# EAGLE design receiver (EAGLE 7.3.0)
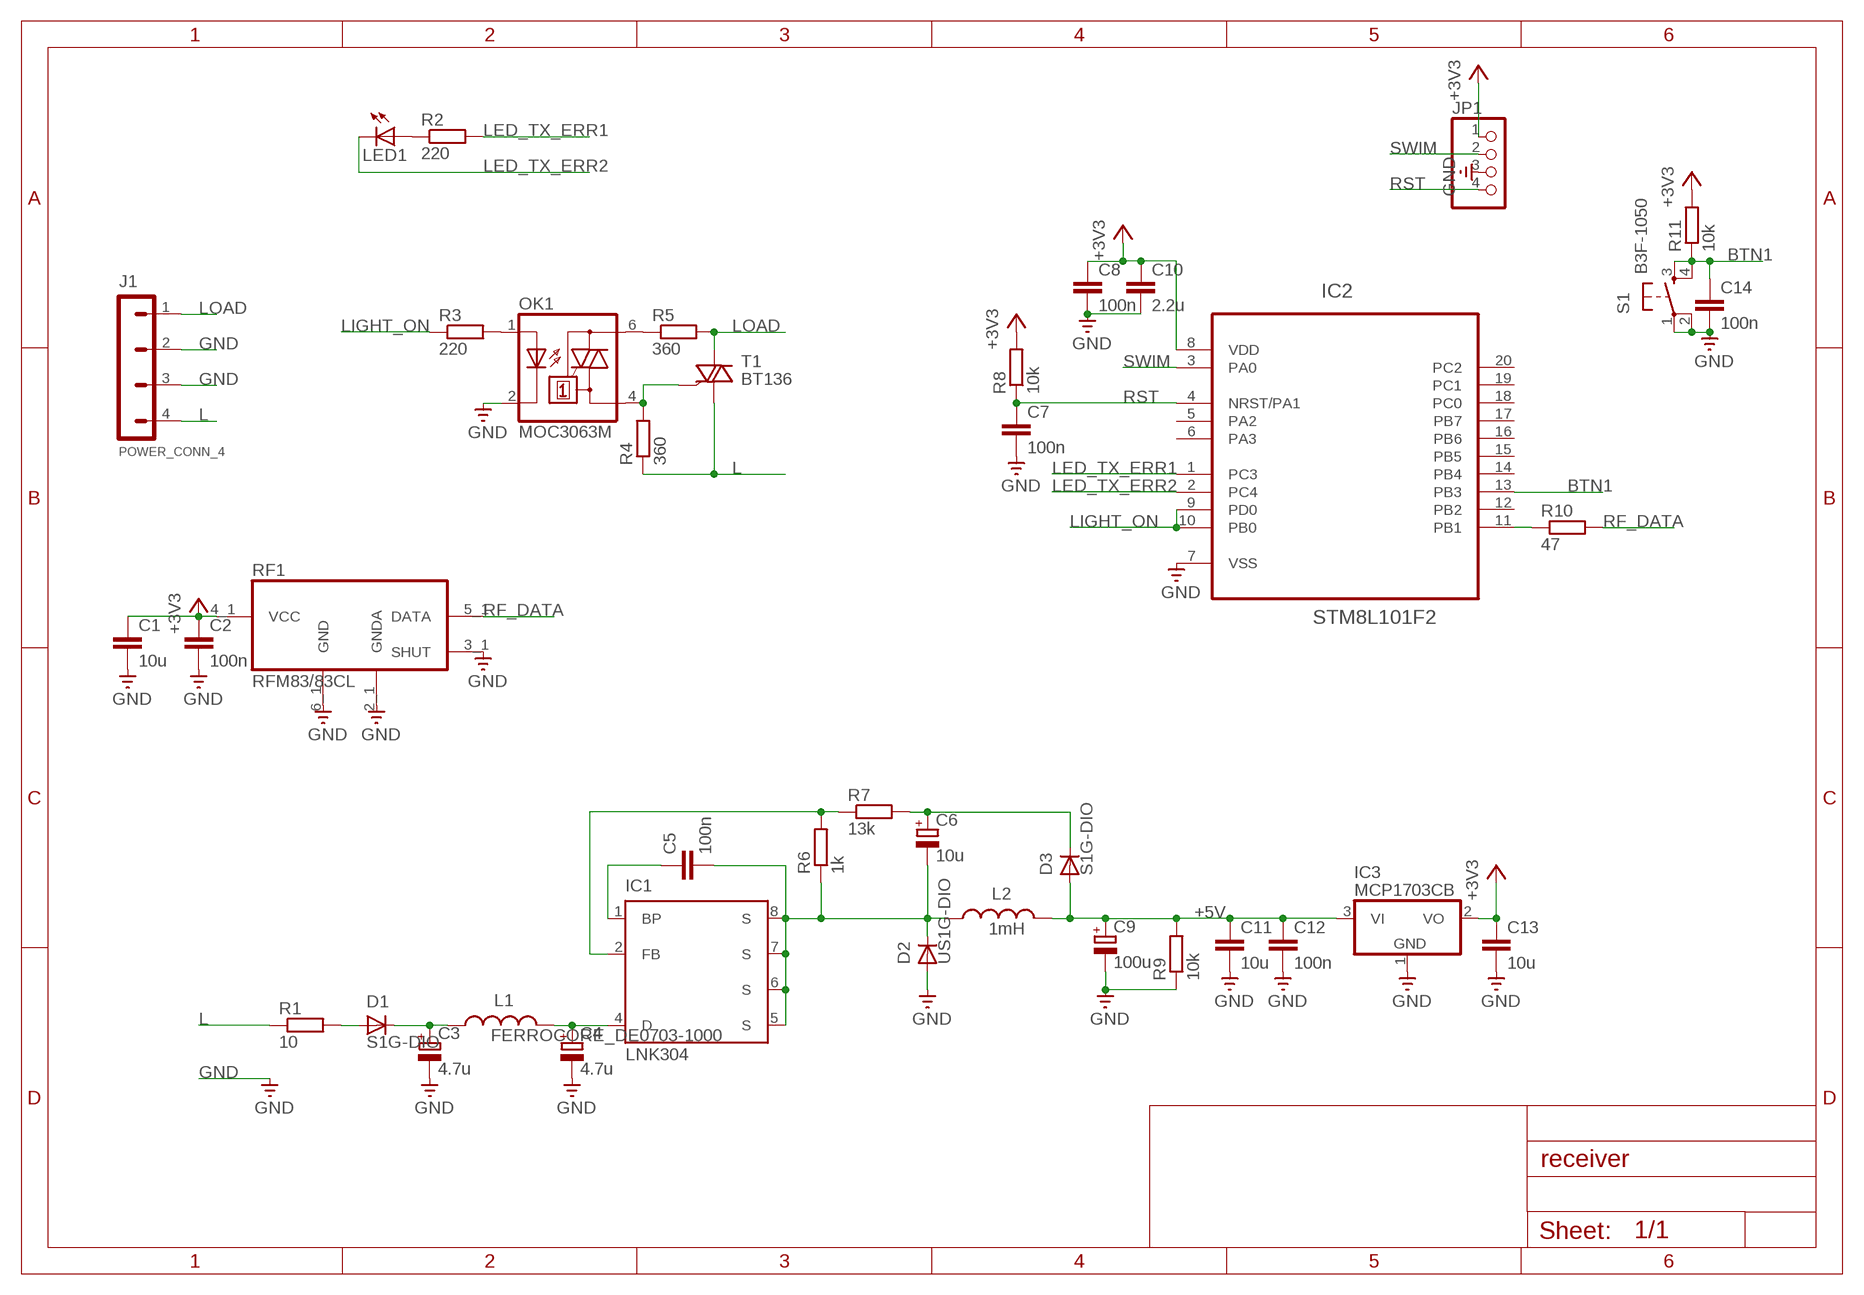
[diagram p0: schematic, sheet 1]

## Parts
C1  10u  C-EUC1206  [C1206]
C2  100n  C-EUC0603K  [C0603K]
C3  4.7u  C-POL-EUCAP_10X12.5_AIR  [CAP_10X12.5_AIR]
C4  4.7u  C-POL-EUE5-10,5  [E5-10,5]
C5  100n  C-EUC0603K  [C0603K]
C6  10u  C_POL_PANASONIC_C_LARGER_PADS  [PANASONIC_C_LARGER_PADS]
C7  100n  C-EUC0603K  [C0603K]
C8  100n  C-EUC0603K  [C0603K]
C9  100u  C-POL_PANASONC_D_LARGER_PADS  [PANASONIC_D_LARGER_PADS]
C10  2.2u  C-EUC1206  [C1206]
C11  10u  C-EUC1206  [C1206]
C12  100n  C-EUC0603K  [C0603K]
C13  10u  C-EUC1206  [C1206]
C14  100n  C-EUC0603K  [C0603K]
D1  S1G-DIO  [DO214-AC]
D2  US1G-DIO  [DO214-AC]
D3  S1G-DIO  [DO214-AC]
IC1  LNK304  [SO8_NO_PIN3]
IC2  STM8L101F2  [TSSOP20]
IC3  MCP1703CB  [SOT23]
J1  POWER_CONN_4  [TERMINAL_BLOCK_4]
JP1  CON_1X4PIN_2.54MM_SMD  [CON_1X4_2.54_SMD]
L1  FERROCORE_DE0703-1000  [DE0703]
L2  1mH  FERROCORE_DE0703-1000  [DE0703]
LED1  LED3MM  [LED3MM]
OK1  MOC3063M  MOC3023M  [DIL06]
R1  10  R_R2512_LARGER_PADS  [R2512_LARGER_PADS]
R2  220  R-EU_R0603  [R0603]
R3  220  R-EU_R0603  [R0603]
R4  360  R-EU_R0603  [R0603]
R5  360  R-EU_R0603  [R0603]
R6  1k  R-EU_R0603  [R0603]
R7  13k  R-EU_R0603  [R0603]
R8  10k  R-EU_R0603  [R0603]
R9  10k  R-EU_R0603  [R0603]
R10  47  R-EU_R0603  [R0603]
R11  10k  R-EU_R0603  [R0603]
RF1  RFM83/83CL  [RFM83C/83CL_CONN]
S1  B3F-1050  DTS-6  [DTS-6]
T1  BT136  [TO220AB]

## Nets
+3V3: C1.1 C2.1 C8.1 C10.1 C13.1 IC2.8(VDD) IC3.2(VO) JP1.1 R8.2 R11.2 RF1.4_1(VCC)
+5V: C9.+ C11.1 C12.1 D3.A IC3.3(VI) L2.P$2 R9.2
BTN1: C14.1 IC2.13(PB3) R11.1 S1.3 S1.4
GND: C1.2 C2.2 C3.- C4.- C7.2 C8.2 C9.- C10.2 C11.2 C12.2 C13.2 C14.2 D2.A IC2.7(VSS) IC3.1(GND) J1.2 J1.3 JP1.3 OK1.2(C) R9.1 RF1.2_1(GNDA) RF1.3_1(SHUT) RF1.6_1(GND) S1.1 S1.2
L: J1.4 R1.1 R4.1 T1.1(A1)
LED_TX_ERR1: IC2.1(PC3) R2.2
LED_TX_ERR2: IC2.2(PC4) LED1.K(C)
LIGHT_ON: IC2.9(PD0) IC2.10(PB0) R3.1
LOAD: J1.1 R5.2 T1.2(A2)
N$1: C4.+ IC1.4(D) L1.P$2
N$2: LED1.A R2.1
N$3: C6.+ D3.C R7.2
N$4: IC1.2(FB) R6.2 R7.1
N$5: C5.1 IC1.1(BP)
N$6: C5.2 C6.- D2.C IC1.5(S) IC1.6(S) IC1.7(S) IC1.8(S) L2.P$1 R6.1
N$7: OK1.6(A2) R5.1
N$8: OK1.4(A1) R4.2 T1.3(G)
N$9: IC2.11(PB1) R10.1
N$10: C3.+ D1.C L1.P$1
N$11: OK1.1(A) R3.2
N$12: D1.A R1.2
RF_DATA: R10.2 RF1.5_1(DATA)
RST: C7.1 IC2.4(NRST/PA1) JP1.4 R8.1
SWIM: IC2.3(PA0) JP1.2
Unconnected: IC2.5(PA2) IC2.6(PA3) IC2.12(PB2) IC2.14(PB4) IC2.15(PB5) IC2.16(PB6) IC2.17(PB7) IC2.18(PC0) IC2.19(PC1) IC2.20(PC2)

## Library data of the parts
C1 C2 C5 C7 C8 C10-C14 = resistor:C-EU: CAPACITOR, European symbol
C3 C4 = comp_RFSwitch_v3:C-POL-EU
C6 = comp_RFSwitch_v3:C_POL_PANASONIC_C_LARGER_PADS
C9 = comp_RFSwitch_v3:C-POL_PANASONC_D_LARGER_PADS
D1 D3 = comp_RFSwitch_v3:S1G-DIO
D2 = comp_RFSwitch_v3:US1G-DIO
IC1 = comp_RFSwitch_v3:LNK304
IC2 = comp_RFSwitch_v3:STM8L101F2
IC3 = linear:MCP1703: 250 mA, 16V, Low Quiescent Current LDO Regulator Source: http://ww1.microchip.com/downloads/en/DeviceDoc/22049b.pdf
J1 = CarReceiver:POWER_CONN_4
JP1 = comp_RFSwitch_v3:CON_1X4PIN_
L1 L2 = comp_RFSwitch_v3:FERROCORE_DE0703-1000
LED1 = led:LED: LED OSRAM: - CHIPLED LG R971, LG N971, LY N971, LG Q971, LY Q971, LO R971, LY R971 LH N974, LH R974 LS Q976, LO Q976, LY Q976 LO Q996 - Hyper CHIPLED LW Q18S LB Q993, LB Q99A, LB R99A - SideLED LS A670, LO A670, LY A670, LG A670, LP A670 LB A673, LV A673, LT A673, LW A673 LH A674 LY A675 LS A676, LA A676, LO A676, LY A676, LW A676 LS A679, LY A679, LG A679 - Hyper Micro SIDELED® LS Y876, LA Y876, LO Y876, LY Y876 LT Y87S - SmartLED LW L88C, LW L88S LB L89C, LB L89S, LG L890 LS L89K, LO L89K, LY L89K LS L896, LA L896, LO L896, LY L896 - TOPLED LS T670, LO T670, LY T670, LG T670, LP T670 LSG T670, LSP T670, LSY T670, LOP T670, LYG T670 LG T671, LOG T671, LSG T671 LB T673, LV T673, LT T673, LW T673 LH T674 LS T676, LA T676, LO T676, LY T676, LB T676, LH T676, LSB T676, LW T676 LB T67C, LV T67C, LT T67C, LS T67K, LO T67K, LY T67K, LW E67C LS E67B, LA E67B, LO E67B, LY E67B, LB E67C, LV E67C, LT E67C LW T67C LS T679, LY T679, LG T679 LS T770, LO T770, LY T770, LG T770, LP T770 LB T773, LV T773, LT T773, LW T773 LH T774 LS E675, LA E675, LY E675, LS T675 LS T776, LA T776, LO T776, LY T776, LB T776 LHGB T686 LT T68C, LB T68C - Hyper Mini TOPLED® LB M676 - Mini TOPLED Santana® LG M470 LS M47K, LO M47K, LY M47K Source: http://www.osram.convergy.de LUXEON: - LUMILED® LXK2-PW12-R00, LXK2-PW12-S00, LXK2-PW14-U00, LXK2-PW14-V00 LXK2-PM12-R00, LXK2-PM12-S00, LXK2-PM14-U00 LXK2-PE12-Q00, LXK2-PE12-R00, LXK2-PE12-S00, LXK2-PE14-T00, LXK2-PE14-U00 LXK2-PB12-K00, LXK2-PB12-L00, LXK2-PB12-M00, LXK2-PB14-N00, LXK2-PB14-P00, LXK2-PB14-Q00 LXK2-PR12-L00, LXK2-PR12-M00, LXK2-PR14-Q00, LXK2-PR14-R00 LXK2-PD12-Q00, LXK2-PD12-R00, LXK2-PD12-S00 LXK2-PH12-R00, LXK2-PH12-S00 LXK2-PL12-P00, LXK2-PL12-Q00, LXK2-PL12-R00 Source: www.luxeon.com KINGBRIGHT: KA-3528ASYC Source: www.kingbright.com
OK1 = optocoupler:MOC30*M: RANDOM-PHASE OPTOISOLATORS TRIAC DRIVER OUTPUT Source: http://www.fairchildsemi.com MOC3020-M.pdf; MF: FAIRCHILD SEMICONDUCTOR; MPN: MOC3023-M; OC_FARNELL: 1021367; OC_NEWARK: 72K8896
R1 = comp_RFSwitch_v3:R_
R2-R11 = resistor:R-EU_: RESISTOR, European symbol
RF1 = comp_RFSwitch_v3:RFM83/83CL
S1 = switch-tact:DTS-6
T1 = triac:BT136: Triac BT136 series E sensitive gate Source: http://www.nxp.com/acrobat_download/datasheets/BT136_SERIES_E_2.pdf

## Net classes
0 default: clearance 0.205 mm

## Board
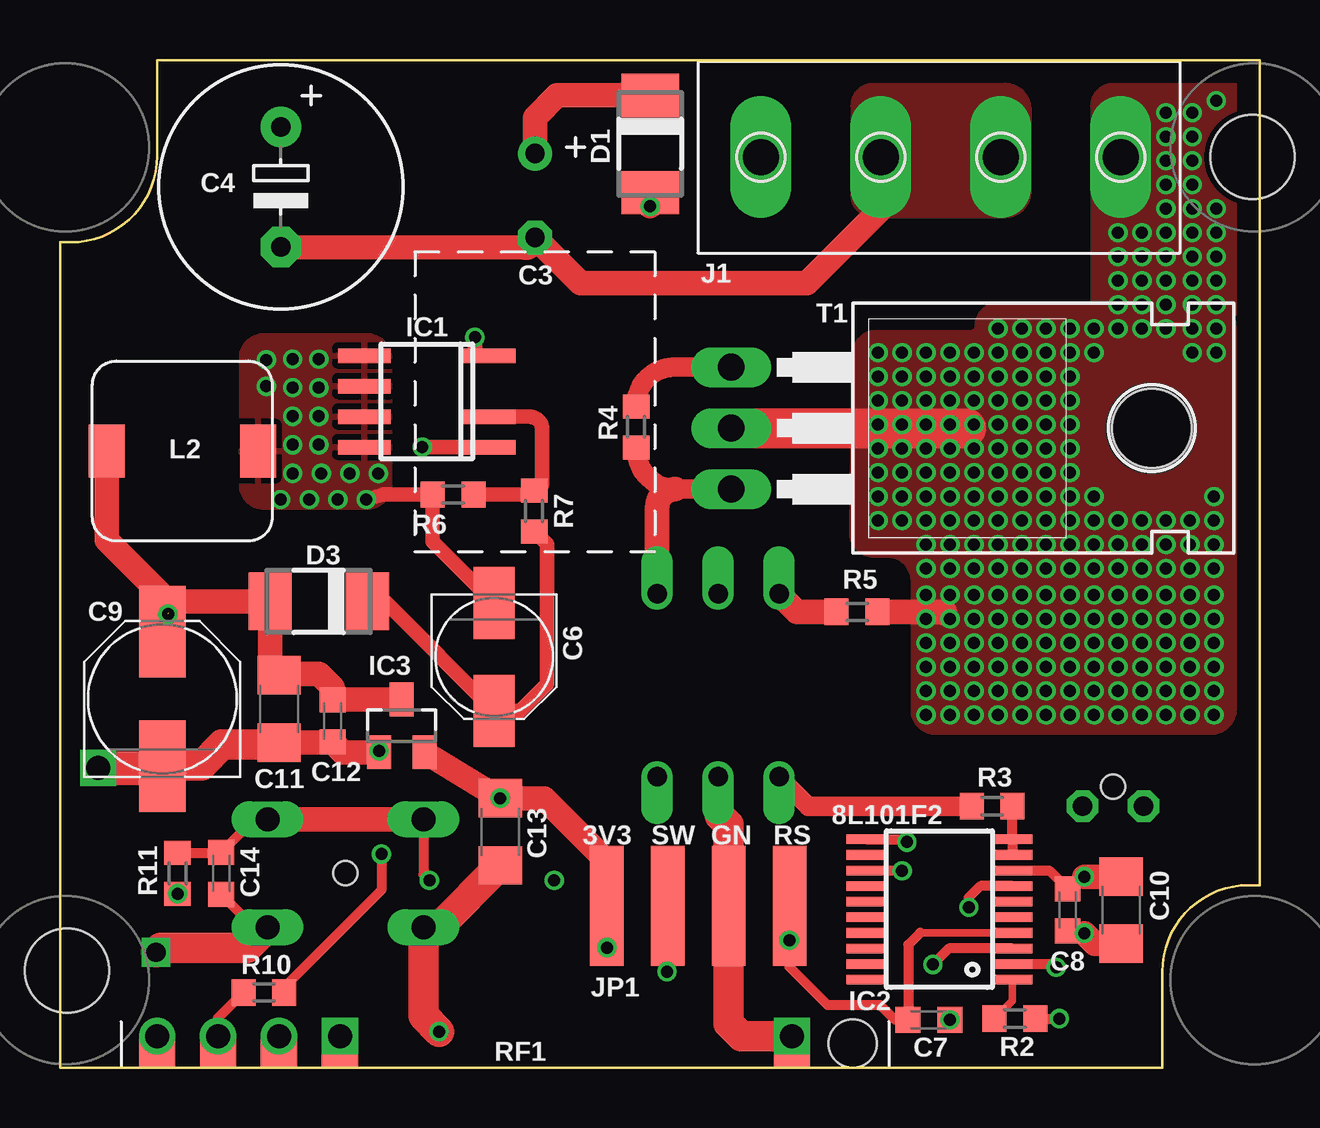
[diagram p1: board, top side]
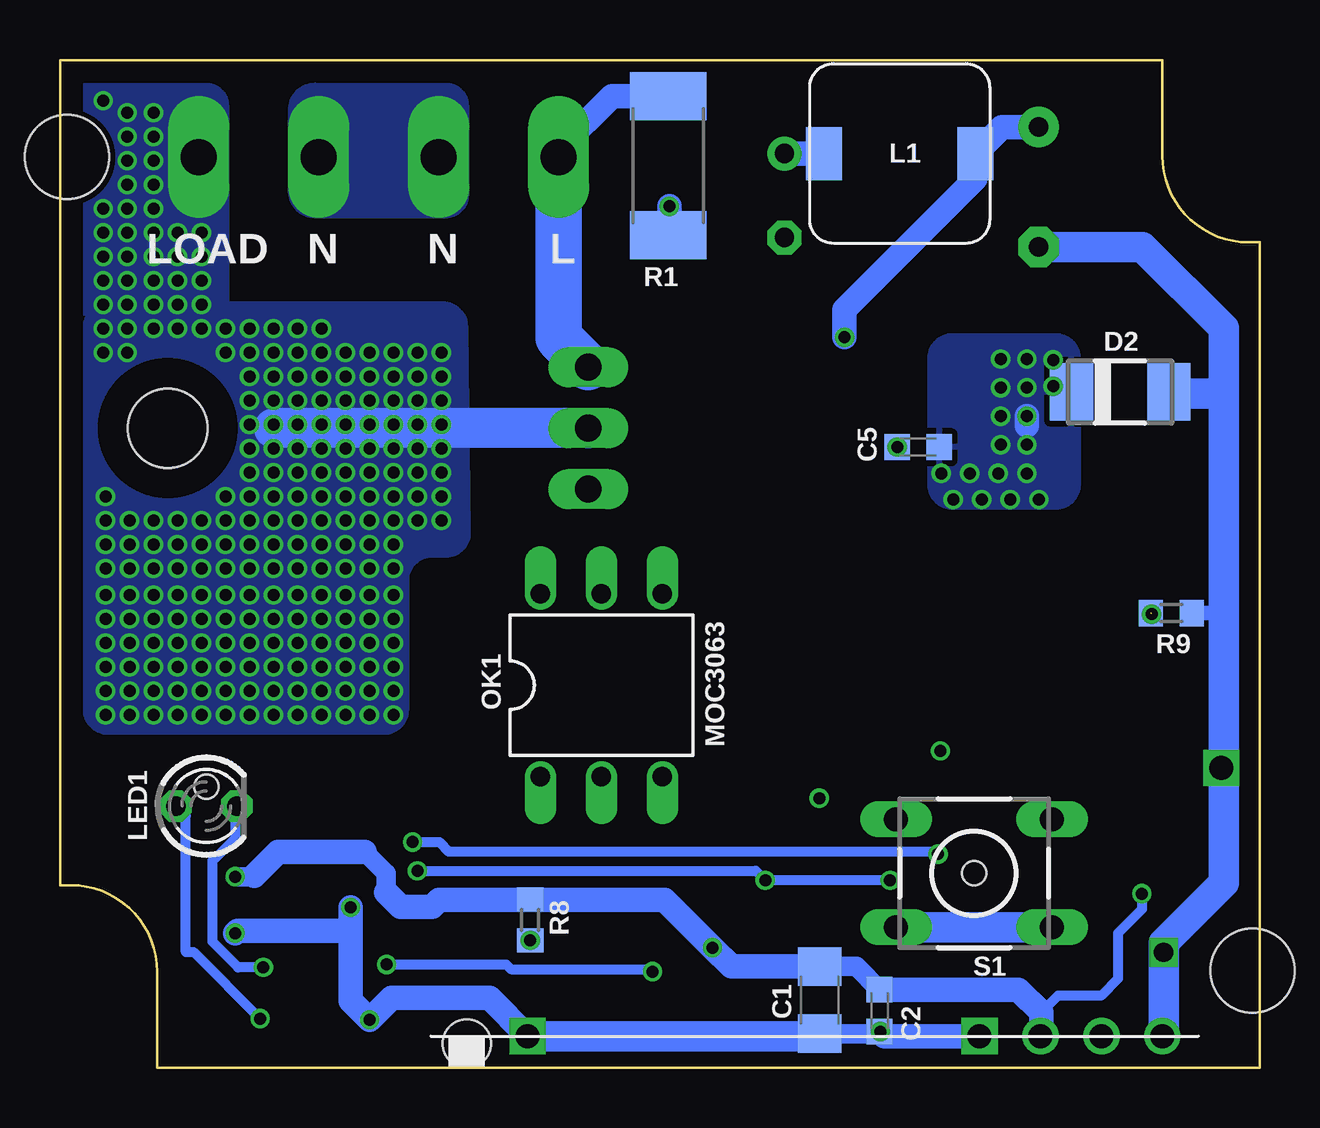
[diagram p2: board, bottom side, seen from below]

Size 50 x 42 mm. Coordinates in mm from the lower left corner, seen from the top.
Outline: 4.05,42 4.05,38 arc-90 0.45,34.4 0,34.4 0,0 45.95,0 45.95,4 arc-90 49.55,7.6 50,7.6 50,42 4.05,42
Copper layers (1*16): Top 0.035mm / dielectric 1.5mm / Bottom 0.035mm
Design rules "SeeedStudio_2layer_DRU_no_angle_20140221": minimum track width 6mil, minimum drill 12mil, track to track 6mil, track to pad 6mil, pad to pad 6mil, via to via 6mil, smd to smd 0mil, copper to edge 10mil, drill to drill 10mil, minimum pad ring 10mil, minimum via ring 6mil, stop-mask expansion 2mil, vias tented up to drill 100mil, thermal gap 10mil
Holes 3.5 mm at 49.7,37.95 0.3,4.05
Holes 1 mm at 11.9,8.1 43.9,11.7
Holes 2 mm at 33.05,1

### Footprints (pad centres in the part's own frame; a part is rotated, then mirrored left to right if it is on the bottom)
C1206 = smd 1.6 x 1.8: 1 -1.4,0; 2 1.4,0
C0603K = smd 1.05 x 1.08: 1 -0.875,0; 2 0.875,0
CAP_10X12.5_AIR = drill 0.8 pad 1.422: + -3.5,0 | drill 0.8 pad 1.422 octagon: - 0,0
E5-10,5 = drill 0.8 pad 1.676: + -2.5,0 | drill 0.8 pad 1.676 octagon: - 2.5,0
PANASONIC_C_LARGER_PADS = smd 3 x 1.7: + 2.25,0; - -2.25,0
PANASONIC_D_LARGER_PADS = smd 3.81 x 1.93: + 2.8,0; - -2.8,0
DO214-AC = smd 1.8 x 2.4: A 2.025,0; C -2.025,0
SO8_NO_PIN3 = smd 0.6 x 2.2: 1 -1.905,-2.6; 2 -0.635,-2.6; 4 1.905,-2.6; 5 1.905,2.6; 6 0.635,2.6; 7 -0.635,2.6; 8 -1.905,2.6
TSSOP20 = smd 0.4 x 1.65: 1 -3.575,-3.05; 2 -2.925,-3.05; 3 -2.275,-3.05; 4 -1.625,-3.05; 5 -0.975,-3.05; 6 -0.325,-3.05; 7 0.325,-3.05; 8 0.975,-3.05; 9 1.625,-3.05; 10 2.275,-3.05; 11 2.275,3.05; 12 1.625,3.05; 13 0.975,3.05; 14 0.325,3.05; 15 -0.325,3.05; 16 -0.975,3.05; 17 -1.625,3.05; 18 -2.275,3.05; 19 -2.925,3.05; 20 -3.575,3.05
SOT23 = smd 1 x 1.4: 1 -0.95,-1.1; 2 0.95,-1.1; 3 0,1.1
TERMINAL_BLOCK_4 = drill 1.5 pad 2.54 long: 1 0,7.58; 2 0,2.58; 3 0,-2.42; 4 0,-7.42
CON_1X4_2.54_SMD = smd 1.4 x 5: 1 -3.81,2.25; 2 -1.27,2.25; 3 1.27,2.25; 4 3.81,2.25
DE0703 = smd 2.2 x 1.5: P$1 0,3.15; P$2 0,-3.15
LED3MM = drill 0.813 octagon: A -1.27,0; K 1.27,0
DIL06 = drill 0.813 offset: 1 -2.54,-3.81; 2 0,-3.81; 3 2.54,-3.81; 4 2.54,3.81; 5 0,3.81; 6 -2.54,3.81
R2512_LARGER_PADS = smd 2 x 3.2: 1 -2.9,0; 2 2.9,0
R0603 = smd 1 x 1.1: 1 -0.85,0; 2 0.85,0
RFM83C/83CL_CONN = drill 1 square: 2_1 2.54,0; 3_1 21.38,0 | drill 1: 4_1 23.92,0; 5_1 26.46,0; 6_1 29,0 | smd 1.505 x 0.6 bottom: P$1 2.54,-1; P$2 21.38,-1 | smd 1.505 x 1.3 bottom: P$3 23.92,-0.65; P$4 26.46,-0.65; P$5 29,-0.65
DTS-6 = drill 1 long: 1 -3.25,2.25; 2 3.25,2.25; 3 -3.25,-2.25; 4 3.25,-2.25
TO220AB = drill 1.118 long: 1 -2.54,-6.35; 2 0,-6.35; 3 2.54,-6.35 | hole 3.302: 0,11.176

### Placement (x,y rotation side)
C1  18.33,2.81 270 bottom
C2  15.84,2.37 270 bottom
C3  19.8,34.6 270 top
C4  9.21,36.71 270 top
C5  14.23,25.86 0 bottom
C6  18.1,17.12 270 top
C7  36.22,1.99 0 top
C8  42,6.58 270 top
C9  4.27,15.36 90 top
C10  44.23,6.56 270 top
C11  9.13,14.95 270 top
C12  11.36,14.45 270 top
C13  18.35,9.83 270 top
C14  6.73,8.1 270 top
D1  24.6,38.5 270 top
D2  5.81,28.16 0 bottom
D3  10.78,19.43 180 top
IC1  15.29,27.77 90 top
IC2  36.66,7.24 90 top
IC3  14.24,14.24 0 top
J1  36.63,37.95 270 top
JP1  26.6,4.5 0 top
L1  15,38.1 90 bottom
L2  5.1,25.7 270 top
LED1  43.9,10.9 0 bottom
OK1  27.43,15.93 0 bottom
R1  24.65,37.6 270 bottom
R2  39.8,2.04 180 top
R3  38.85,10.89 180 top
R4  24.02,26.7 270 top
R5  33.22,19 0 top
R6  16.39,23.89 0 top
R7  19.77,23.2 270 top
R8  30.4,6.16 90 bottom
R9  3.68,18.94 180 bottom
R10  8.5,3.13 180 top
R11  4.9,8.09 270 top
RF1  33.05,1.31 0 bottom
S1  11.9,8.1 180 bottom
T1  34.33,26.65 270 top

### Tracks (layer width: path | path; a pad name or v marks a point on that pad's centre or on a via)
+3V3  (via drill 0.5)
  Top 0.406: JP1.1 v22.79,5.01 v22.8,5 | IC2.8 41.24,8.21 C8.1 42.2,7.45 v42.7,7.95
  Top 1.016: IC3.2 C13.1 20.17,11.23 22.8,8.6 JP1.1 | v42.7,7.95 C10.1
  Bottom 0.406: R8.2 30.49,7.01 30.5,7 | R11.2 4.9,6.6 5.9,5.6 5.9,3.7 6.6,3 8.4,3 9.1,2.3
  Bottom 0.813: C2.1 16.8,4.21 C1.1 18.41,4.21 | 37.31,9 36.4,8.09 36.4,7.3 | v42.7,7.95 41.95,7.95 41.9,8
  Bottom 1.016: 37.31,9 40.9,9 41.9,8 | C2.1 10.05,3.25 9.1,2.3 9.1,1.33 RF1.4_1 | C1.1 22.01,4.21 v22.8,5 24.8,7 30.5,7 34.2,7 34.5,6.7 35.8,6.7 36.4,7.3
  other vias: 4.9,7.24 18.35,11.23
+5V  (via drill 0.5)  (1 unrouted)
  Top 0.61: C9.+ 4.34,19.06 arc-90 v4.5,18.9
  Top 1.016: IC3.3 11.38,15.34 C12.1 11.36,15.84 10.8,16.4 9.19,16.4 C11.1 8.76,16.72 D3.A 4.5,19.43 | 4.5,19.43 v4.5,18.9 | L2.P$2 1.95,21.98 4.5,19.43
BTN1  (via drill 0.5)
  Top 0.406: S1.4 15.15,8.05 v15.4,7.8 | IC2.13 35.1,8.21 v35.1,8.2 | S1.3 8.1,10.35 C14.1 6.7,8.94 R11.1
  Top 1.016: S1.4 S1.3
  Bottom 0.406: v35.1,8.2 21,8.2 v20.6,7.8 v15.4,7.8
GND  (via drill 0.5, 0.8, 1)
  Top 0.406: IC2.7 38.37,7.56 37.88,7.09 v37.88,6.68 | IC3.1 v13.29,13.19 v13.3,13.2 | C14.2 8.1,5.85 S1.1
  Top 0.813: v42.7,5.6 42.1,5.6 C8.2
  Top 1.016: 9.05,13.46 C11.2 11.33,13.55 C12.2 11.79,13.14 IC3.1 | 27.5,10.5 27.5,12.06 OK1.2 | J1.3 34.2,35.76 31.14,32.7 21.7,32.7 C3.- arc-90 19.37,34.17 C4.- | v42.7,5.6 43.14,5.16 C10.2
  Top 1.27: 27.5,10.5 27.87,10.13 JP1.3 27.87,1.84 28.4,1.31 RF1.2_1 | C13.2 15.78,5.85 S1.2 15.15,2.15 v15.8,1.5 | S1.1 7.8,5 4.2,5 v4,4.8 | 9.05,13.46 6.76,13.46 5.9,12.6 4.31,12.6 C9.-
  Top 1.422: v1.6,12.5 4.21,12.5 C9.-
  Bottom 0.406: v1.6,12.5 1.49,12.5 1.49,11.4
  Bottom 0.61: v15.8,1.5 C2.2 | 1.49,22.04 1.49,22.1 | R9.1 1.64,18.94 arc90 1.49,18.8
  Bottom 0.813: C2.2 15.92,1.41 C1.2
  Bottom 1.016: v37.88,6.68 37.88,5.86 | 37.88,5.86 38.04,5.7 42.6,5.7 v42.7,5.6 | RF1.3_1 15.64,1.3 C2.2 | RF1.2_1 32.1,2.9 36.18,2.9 C7.2 37.88,2.79 37.88,5.86
  Bottom 1.27: S1.2 S1.1 | RF1.2_1 18.43,1.31 C1.2 | RF1.6_1 4,1.36 v4,4.8 4,5.2 1.49,7.71 1.49,11.4 1.49,18.8 1.49,22.1 1.49,28.1 | 1.49,28.1 1.49,30.82 4.88,34.21 C4.- | D2.A 3.72,28.1 1.49,28.1
  other vias: 37.09,1.99
  pour Top (no thermals): 33,36.46 33,40 arc-90 33.84,41 39.27,41 arc-90 40.45,40 40.45,36.46 arc-90 39.27,35.46 33.84,35.46 arc-90
  pour Bottom (no thermals): 39.27,35.46 33.84,35.46 arc-90 33,36.46 33,40 arc-90 33.84,41 39.27,41 arc-90 40.45,40 40.45,36.46 arc-90
L
  Top 0.813: T1.1 25.55,29.19 arc90 R4.1
  Bottom 1.016: J1.4 29.21,38.29 27,40.5 R1.1
  Bottom 1.93: T1.1 29.21,30.42 J1.4
LED_TX_ERR1
  Top 0.305: IC2.1 39.7,2.79 R2.2
LED_TX_ERR2  (via drill 0.5)
  Top 0.406: IC2.2 41.23,4.32 41.37,4.17 v41.53,4.17
  Bottom 0.406: v41.53,4.17 42.57,4.17 43.64,5.24 43.64,8.62 42.69,9.57 42.69,10.84 LED1.K
LIGHT_ON
  Top 0.406: R3.1 IC2.10 IC2.9
LOAD  (via drill 0.5)
  Top 1.016: 34.17,26.63 arc-90 34.2,26.65 | R5.2 36.88,19 36.88,18.93
  Top 1.676: T1.2 34.2,26.65 37.77,26.65
  Bottom 1.676: T1.2 41.07,26.65
  other vias: 34.1,29.8 35.1,29.8 36.1,29.8 37.1,29.8 38.1,29.8 39.1,29.8 40.1,29.8 41.1,29.8 42.1,29.8 34.1,28.8 35.1,28.8 36.1,28.8 37.1,28.8 38.1,28.8 39.1,28.8 40.1,28.8 41.1,28.8 42.1,28.8 34.1,27.8 35.1,27.8 36.1,27.8 37.1,27.8 38.1,27.8 39.1,27.8 40.1,27.8 41.1,27.8 42.1,27.8 34.1,26.8 35.1,26.8 36.1,26.8 37.1,26.8 38.1,26.8 39.1,26.8 40.1,26.8 41.1,26.8 42.1,26.8 34.1,25.8 35.1,25.8 36.1,25.8 37.1,25.8 38.1,25.8 39.1,25.8 40.1,25.8 41.1,25.8 42.1,25.8 34.1,24.8 35.1,24.8 36.1,24.8 37.1,24.8 38.1,24.8 39.1,24.8 40.1,24.8 41.1,24.8 42.1,24.8 34.1,23.8 35.1,23.8 36.1,23.8 37.1,23.8 38.1,23.8 39.1,23.8 40.1,23.8 41.1,23.8 42.1,23.8 34.1,22.8 35.1,22.8 36.1,22.8 37.1,22.8 38.1,22.8 39.1,22.8 40.1,22.8 41.1,22.8 42.1,22.8 36.1,21.8 37.1,21.8 38.1,21.8 39.1,21.8 40.1,21.8 41.1,21.8 42.1,21.8 43.1,21.8 44.1,21.8 36.1,20.8 37.1,20.8 38.1,20.8 39.1,20.8 40.1,20.8 41.1,20.8 42.1,20.8 43.1,20.8 44.1,20.8 45.1,21.8 46.1,21.8 47.1,21.8 48.1,21.8 45.1,20.8 46.1,20.8 47.1,20.8 48.1,20.8 36.1,19.7 37.1,19.7 38.1,19.7 39.1,19.7 40.1,19.7 41.1,19.7 42.1,19.7 43.1,19.7 44.1,19.7 36.1,18.7 37.1,18.7 38.1,18.7 39.1,18.7 40.1,18.7 41.1,18.7 42.1,18.7 43.1,18.7 44.1,18.7 45.1,19.7 46.1,19.7 47.1,19.7 48.1,19.7 45.1,18.7 46.1,18.7 47.1,18.7 48.1,18.7 36.1,17.7 37.1,17.7 38.1,17.7 39.1,17.7 40.1,17.7 41.1,17.7 42.1,17.7 43.1,17.7 44.1,17.7 36.1,16.7 37.1,16.7 38.1,16.7 39.1,16.7 40.1,16.7 41.1,16.7 42.1,16.7 43.1,16.7 44.1,16.7 45.1,17.7 46.1,17.7 47.1,17.7 48.1,17.7 45.1,16.7 46.1,16.7 47.1,16.7 48.1,16.7 36.1,15.7 37.1,15.7 38.1,15.7 39.1,15.7 40.1,15.7 41.1,15.7 42.1,15.7 43.1,15.7 44.1,15.7 36.1,14.7 37.1,14.7 38.1,14.7 39.1,14.7 40.1,14.7 41.1,14.7 42.1,14.7 43.1,14.7 44.1,14.7 45.1,15.7 46.1,15.7 47.1,15.7 48.1,15.7 45.1,14.7 46.1,14.7 47.1,14.7 48.1,14.7 43.1,22.8 44.1,22.8 43.1,23.8 42.1,30.8 41.1,30.8 40.1,30.8 39.1,30.8 43.1,29.8 43.1,30.8 44.1,30.8 48.1,22.8 47.2,30.8 45.1,30.8 46.1,30.8 48.1,23.8 47.1,22.8 46.1,22.8 45.1,22.8 48.2,30.8 48.2,29.8 47.2,29.8 44.1,32.8 45.1,32.8 46.1,32.8 47.2,32.8 48.2,32.8 48.2,31.8 47.2,31.8 46.1,31.8 45.1,31.8 44.1,31.8 44.1,33.8 45.1,33.8 46.1,33.8 47.2,33.8 48.2,33.8 48.2,34.8 47.2,34.8 46.1,34.8 45.1,34.8 46.1,35.8 47.2,35.8 48.2,35.8 47.2,36.8 46.1,36.8 46.1,37.8 47.2,37.8 47.2,38.8 48.2,40.3 47.2,39.8 46.1,39.8 46.1,38.8 44.1,34.8
  pour Bottom: 49,14.92 49,30.88 arc90 47.97,31.88 34.04,31.88 arc89 33.04,30.89 32.92,22.31 arc91 33.92,21.3 34.5,21.3 arc-90 35.5,20.3 35.5,14.92 arc90 36.5,13.92 47.97,13.92 arc90
  pour Top: 35.5,14.92 35.5,20.3 arc90 34.5,21.3 33.94,21.3 arc-91 32.94,22.31 33.04,29.71 arc-89 34.04,30.7 37.99,30.7 arc90 38.17,30.88 arc-90 39.17,31.88 47.97,31.88 arc-90 49,30.88 49,14.92 arc-90 47.97,13.92 36.5,13.92 arc-90
  pour Top (no thermals): 43,31.38 43,40 arc-90 43.84,41 49,41 49,31.38
  pour Bottom (no thermals): 49,31.38 49,41 43.84,41 arc90 43,40 43,31.38
N$1  (via drill 0.5 pad 0.81)
  Top 0.61: v17.29,30.44 17.29,29.67 IC1.4
  Bottom 1.016: v17.29,30.44 v17.3,30.44 17.3,31.6 11.85,37.05 L1.P$2 10.74,39.21 C4.+
N$2  (via drill 0.5)
  Top 0.406: R2.1 v41.66,2.04
  Bottom 0.406: LED1.A 44.75,10.48 44.75,4.82 44.43,4.82 v41.66,2.04
N$3
  Top 0.61: R7.2 20.3,21.82 20.3,16 19.17,14.87 C6.+ 13.54,19.43 D3.C
N$4
  Top 0.61: 19.87,23.86 R7.1 | 19.85,24.05 R7.1 | R6.2 19.6,23.89 R7.1 | IC1.2 19.57,27.13 arc-90 20.1,26.6 20.1,24.39 arc-90 R7.1
N$5  (via drill 0.5)
  Top 0.61: IC1.1 | IC1.1 | IC1.1 16.14,25.86 arc45 16.14,25.86 C5.1
  other vias: 15.1,25.86
N$6  (via drill 0.5)
  Top 0.406: IC1.5
  Top 0.61: IC1.8 | v12.77,23.68 13.47,23.89 R6.1 15.54,21.93 C6.-
  Bottom 1.016: 9.7,26.76 v9.7,27.15
  other vias: 9.2,23.68 10.39,23.68 11.58,23.68 12.08,24.77 13.27,24.77 9.7,29.53 9.7,24.77 9.7,25.96 9.7,28.34 10.79,29.53 10.89,24.77 10.79,25.96 10.79,27.15 10.79,28.34 8.6,29.5 8.6,28.4
  pour Top: 13.8,29.56 13.8,24.3 arc-90 12.8,23.3 8.5,23.3 arc-90 7.5,24.3 7.5,29.56 arc-90 8.5,30.56 12.8,30.56 arc-90
  pour Bottom: 8.5,23.3 12.8,23.3 arc90 13.8,24.3 13.8,29.56 arc90 12.8,30.56 8.5,30.56 arc90 7.5,29.56 7.5,24.3 arc90
N$7
  Top 1.016: OK1.6 30.72,19 R5.1
N$8
  Top 0.813: T1.3 25.66,24.11 arc-90 R4.2 | 27.97,24.1 T1.3 | T1.3 | 28,24.1 T1.3
  Top 1.016: OK1.4 24.89,23.35 arc-90 25.66,24.11
N$9  (via drill 0.5)
  Top 0.406: IC2.11 35.19,9.52 v35.3,9.4 | v13.4,8.9 13.4,7.4 9.35,3.35 R10.1
  Bottom 0.406: v35.3,9.4 34.19,9.4 33.78,9 13.5,9 v13.4,8.9
N$10
  Top 1.016: D1.C 20.73,40.52 19.8,39.6 C3.+
  Bottom 1.016: L1.P$1 C3.+
N$11
  Top 0.813: R3.2 31.2,10.89 OK1.1
N$12  (via drill 0.5)
  Top 1.016: v24.6,35.9 D1.A
  Bottom 1.016: R1.2 arc-90 24.6,34.75 v24.6,35.9
RF_DATA
  Top 0.406: RF1.5_1 6.59,2.07 R10.2
RST  (via drill 0.5)
  Top 0.305: IC2.4 35.86,5.62 | 35.45,2.1 C7.1
  Top 0.406: 35.86,5.62 35.36,5.12 35.36,2.01 C7.1 34.81,1.99 34.2,2.6 32,2.6 30.4,4.2 v30.4,5.3 30.3,5.4 30.3,5.88 30.41,5.99 JP1.4
  Bottom 0.406: R8.1 v30.4,5.3
SWIM  (via drill 0.5)
  Top 0.406: v25.3,4 25.3,6.72 JP1.2 | IC2.3 37.06,4.96 v36.39,4.3
  Bottom 0.406: v36.39,4.3 31.4,4.3 31.2,4.1 25.4,4.1 v25.3,4

### Text on the board
tPlace: 8L101F2 | 3V3 | SW | GN | RS
bPlace: L | N | N | LOAD | MOC3063